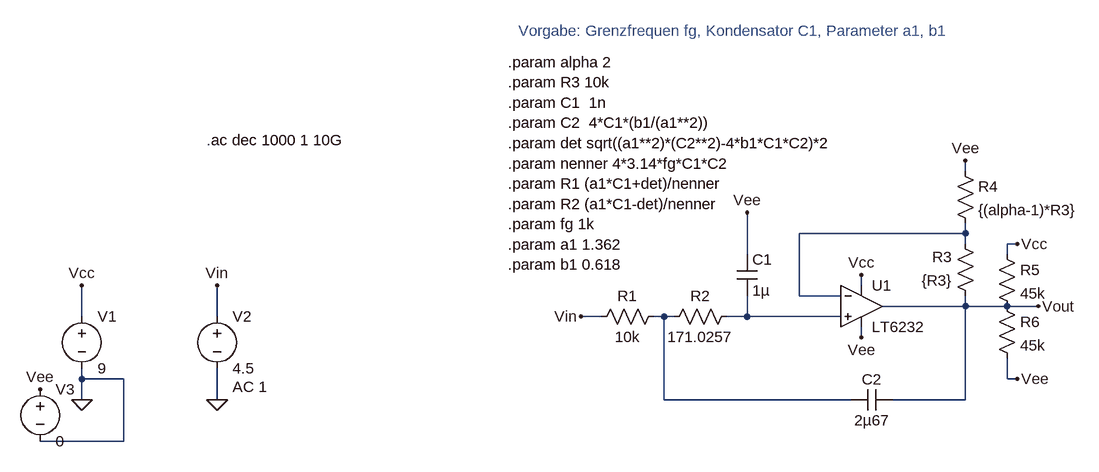
[diagram p0: schematic SallenKeyTP_2Ord.asc]
SallenKeyTP_2Ord.asc, the LTspice schematic file:
Version 4
SHEET 1 2172 680
WIRE 352 -48 352 -64
WIRE 352 48 352 32
WIRE 352 48 96 48
WIRE 352 64 352 48
WIRE 432 64 416 64
WIRE 16 80 16 16
WIRE 416 80 416 64
WIRE 192 128 192 112
WIRE 96 144 96 48
WIRE 160 144 96 144
WIRE 352 160 352 144
WIRE 352 160 224 160
WIRE 416 160 352 160
WIRE 464 160 416 160
WIRE -1008 176 -1008 128
WIRE -800 176 -800 128
WIRE -208 176 -240 176
WIRE -112 176 -128 176
WIRE -96 176 -112 176
WIRE 16 176 16 144
WIRE 16 176 -16 176
WIRE 160 176 16 176
WIRE 192 208 192 192
WIRE -1008 272 -1008 256
WIRE -944 272 -1008 272
WIRE 416 272 416 240
WIRE 432 272 416 272
WIRE -1008 304 -1008 272
WIRE -800 304 -800 256
WIRE -112 304 -112 176
WIRE 176 304 -112 304
WIRE 352 304 352 160
WIRE 352 304 240 304
WIRE -944 368 -944 272
WIRE -944 368 -1072 368
FLAG 192 208 Vee
FLAG 16 16 Vee
FLAG 352 -64 Vee
FLAG 192 112 Vcc
FLAG -240 176 Vin
FLAG 464 160 Vout
FLAG -1008 304 0
FLAG -800 304 0
FLAG -1072 288 Vee
FLAG -1008 128 Vcc
FLAG -800 128 Vin
FLAG 432 64 Vcc
FLAG 432 272 Vee
SYMBOL Opamps\\LT6232 192 160 R0
SYMATTR InstName U1
SYMBOL cap 240 288 R90
WINDOW 0 0 32 VBottom 2
WINDOW 3 32 32 VTop 2
SYMATTR InstName C2
SYMATTR Value 2µ67
SYMBOL cap 0 80 R0
SYMATTR InstName C1
SYMATTR Value 1µ
SYMBOL res -112 160 R90
WINDOW 0 0 56 VBottom 2
WINDOW 3 32 56 VTop 2
SYMATTR InstName R1
SYMATTR Value 10k
SYMBOL res 0 160 R90
WINDOW 0 0 56 VBottom 2
WINDOW 3 32 56 VTop 2
SYMATTR InstName R2
SYMATTR Value 171.0257
SYMBOL res 368 160 R180
WINDOW 0 36 76 Left 2
WINDOW 3 36 40 Left 2
SYMATTR InstName R3
SYMATTR Value {R3}
SYMBOL res 336 -64 R0
SYMATTR InstName R4
SYMATTR Value {(alpha-1)*R3}
SYMBOL voltage -1008 160 R0
WINDOW 123 0 0 Left 2
WINDOW 39 0 0 Left 2
SYMATTR InstName V1
SYMATTR Value 9
SYMBOL voltage -800 160 R0
WINDOW 123 24 124 Left 2
WINDOW 39 0 0 Left 2
SYMATTR Value2 AC 1
SYMATTR InstName V2
SYMATTR Value 4.5
SYMBOL res 400 64 R0
SYMATTR InstName R5
SYMATTR Value 45k
SYMBOL res 400 144 R0
SYMATTR InstName R6
SYMATTR Value 45k
SYMBOL voltage -1072 272 R0
WINDOW 123 0 0 Left 2
WINDOW 39 0 0 Left 2
SYMATTR InstName V3
SYMATTR Value 0
TEXT -352 -216 Left 2 !.param alpha 2\n.param R3 10k\n.param C1  1n\n.param C2  4*C1*(b1/(a1**2))\n.param det sqrt((a1**2)*(C2**2)-4*b1*C1*C2)*2\n.param nenner 4*3.14*fg*C1*C2\n.param R1 (a1*C1+det)/nenner\n.param R2 (a1*C1-det)/nenner\n.param fg 1k\n.param a1 1.362\n.param b1 0.618
TEXT -336 -264 Left 2 ;Vorgabe: Grenzfrequen fg, Kondensator C1, Parameter a1, b1
TEXT -816 -96 Left 2 !.ac dec 1000 1 10G

The netlist it stands for:
* SallenKeyTP_2Ord.asc
* U1: LT6232 (symbol Opamps\LT6232 not available, pins judged from their places): In+=N003 In-=N001 V+=Vcc V-=Vee OUT=Vout
C2 Vout N002 2µ67
C1 Vee N003 1µ
R1 N002 Vin 10k
R2 N003 N002 171.0257
R3 Vout N001 {R3}
R4 Vee N001 {(alpha-1)*R3}
V1 Vcc 0 9
V2 Vin 0 4.5 AC 1
R5 Vcc Vout 45k
R6 Vout Vee 45k
V3 Vee 0 0
.param alpha 2
.param R3 10k
.param C1  1n
.param C2  4*C1*(b1/(a1**2))
.param det sqrt((a1**2)*(C2**2)-4*b1*C1*C2)*2
.param nenner 4*3.14*fg*C1*C2
.param R1 (a1*C1+det)/nenner
.param R2 (a1*C1-det)/nenner
.param fg 1k
.param a1 1.362
.param b1 0.618
* Vorgabe: Grenzfrequen fg, Kondensator C1, Parameter a1, b1
.ac dec 1000 1 10G
.backanno
.end